# Altium project Anchor_G431.PrjPcb
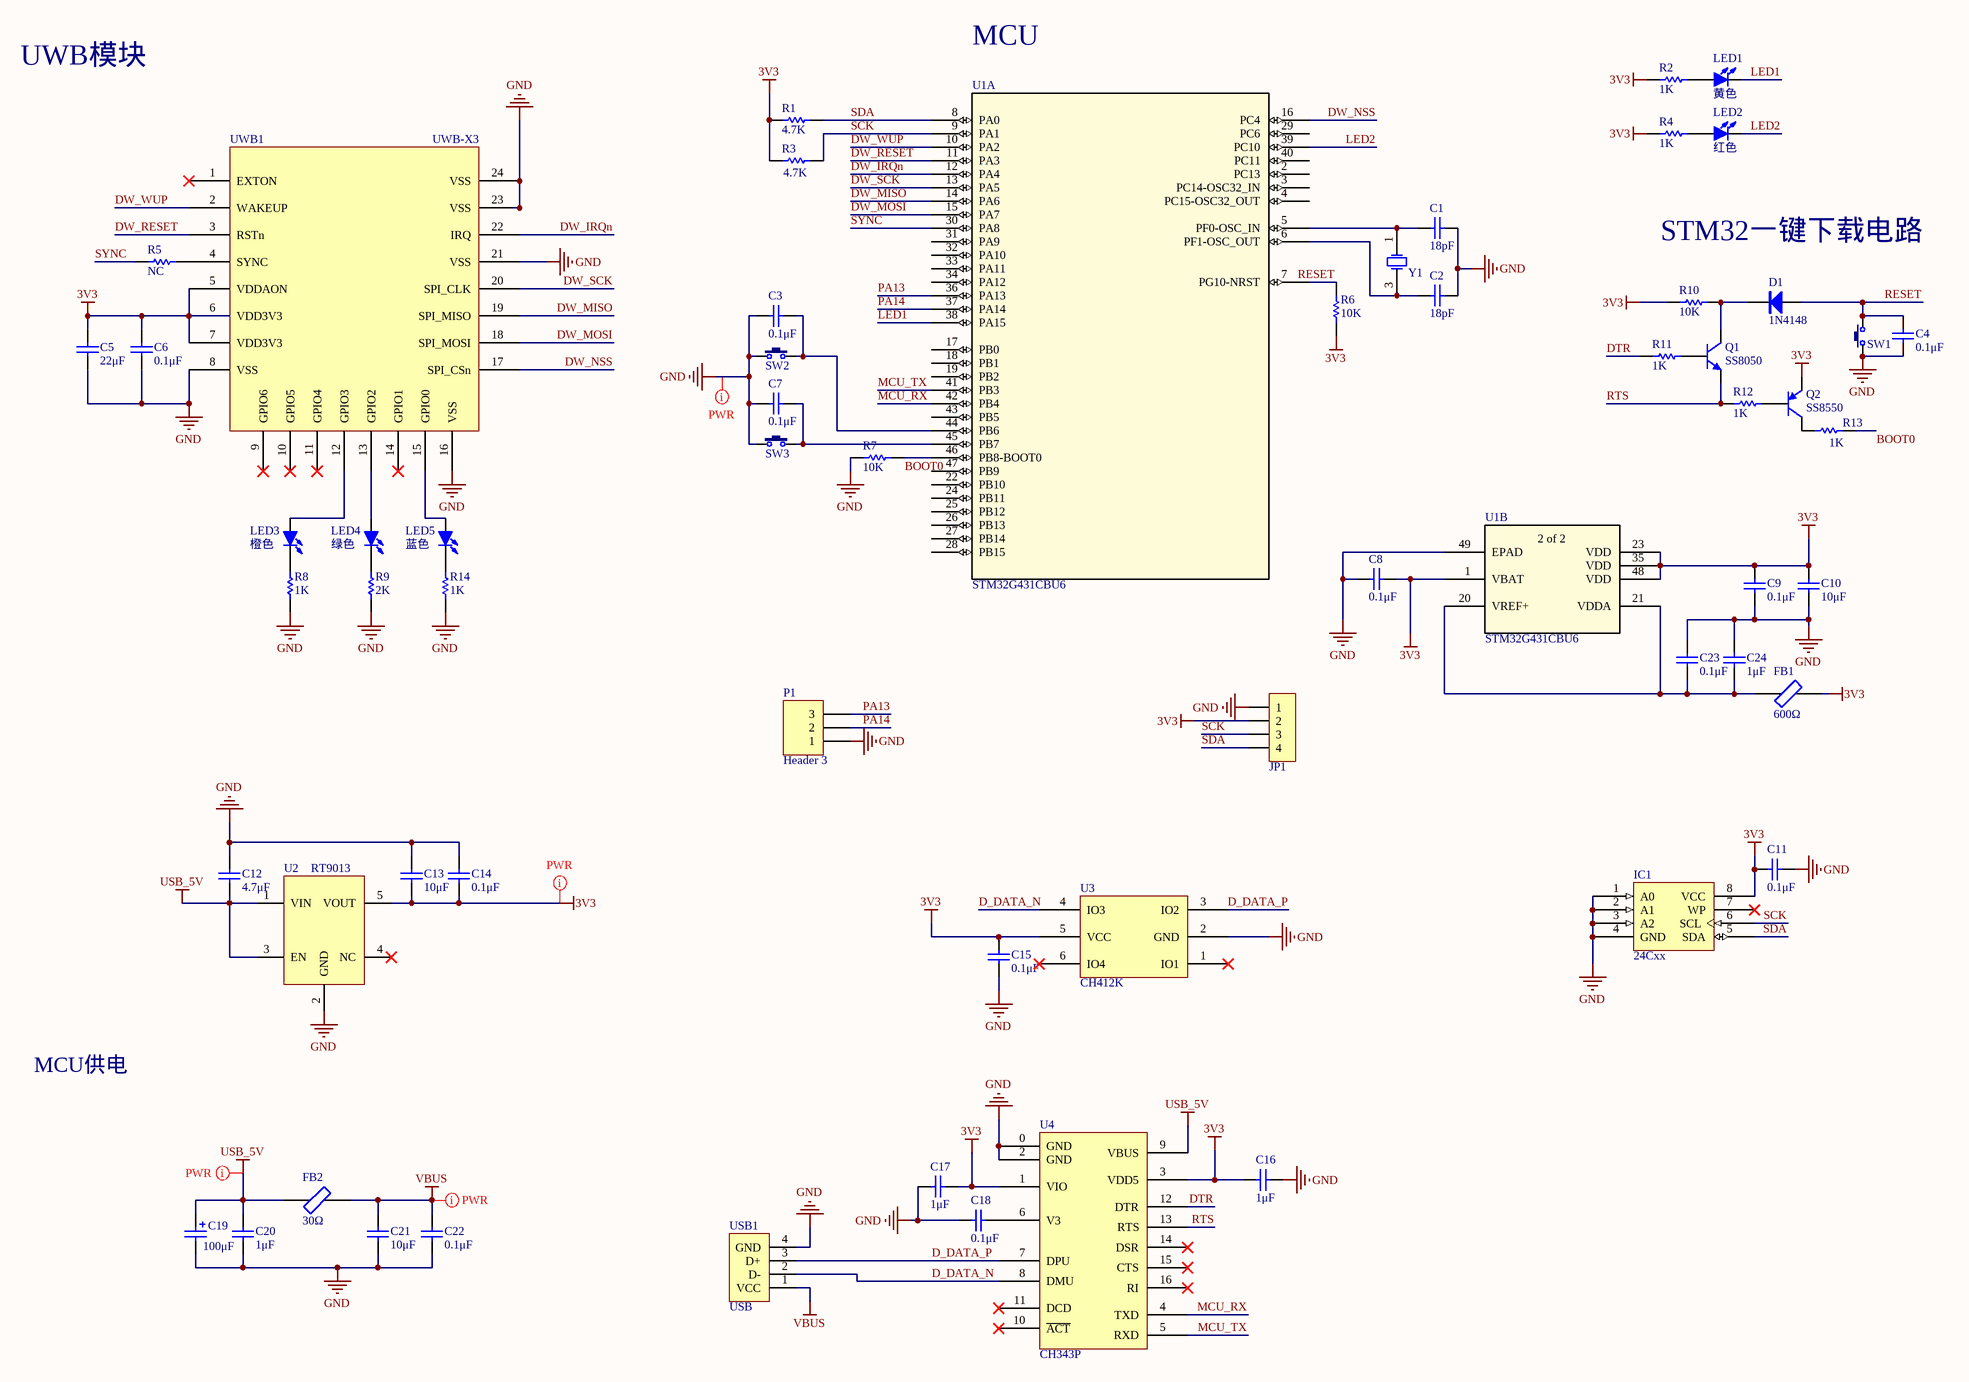
[diagram p0: Anchor_G431.SchDoc]
1 sheet, 61 parts. Net scope: global (net labels, ports and power ports of the same name join across sheets).
Board file: Anchor_G431.PcbDoc

## Sheet Anchor_G431.SchDoc
size A2; SheetNumber: 1; SheetTotal: 1

### Parts
C1  value 18pF  [C 0603_L]  (hidden comment: Cap)
C2  value 18pF  [C 0603_L]  (hidden comment: Cap)
C3  value 0.1μF  [C 0603_L]  (hidden comment: Cap)
C4  value 0.1μF  [C 0603_L]  (hidden comment: Cap)
C5  value 22μF  [C 0603_L]  (hidden comment: Cap)
C6  value 0.1μF  [C 0603_L]  (hidden comment: Cap)
C7  value 0.1μF  [C 0603_L]  (hidden comment: Cap)
C8  value 0.1μF  [C 0603_L]  (hidden comment: Cap)
C9  value 0.1μF  [C 0603_L]  (hidden comment: Cap)
C10  value 10μF  [C 0603_L]  (hidden comment: Cap)
C11  value 0.1μF  [C 0603_L]  (hidden comment: Cap)
C12  value 4.7μF  [C 0603_L]  (hidden comment: Cap)
C13  value 10μF  [C 0603_L]  (hidden comment: Cap)
C14  value 0.1μF  [C 0603_L]  (hidden comment: Cap)
C15  value 0.1μF  [C 0603_L]  (hidden comment: Cap)
C16  value 1μF  [C 0603_L]  (hidden comment: Cap)
C17  value 1μF  [C 0603_L]  (hidden comment: Cap)
C18  value 0.1μF  [C 0603_L]  (hidden comment: Cap)
C19  value 100μF  [CM C(5*5.4)]  (hidden comment: Cap Pol1)
C20  value 1μF  [C 0603_L]  (hidden comment: Cap)
C21  value 10μF  [C 0603_L]  (hidden comment: Cap)
C22  value 0.1μF  [C 0603_L]  (hidden comment: Cap)
C23  value 0.1μF  [C 0603_L]  (hidden comment: Cap)
C24  value 1μF  [C 0603_L]  (hidden comment: Cap)
D1  1N4148  [SOD-323]
FB1  value 600Ω  [C 0603_L]  (hidden comment: Ferrite bead)
FB2  value 30Ω  [C 0603_L]  (hidden comment: Ferrite bead)
IC1  24Cxx  [SOP8_L]
JP1  HDR-1X4  [HDR2.54-LI-4P]  (value not drawn)
LED1  黄色  [LED 0805G]
LED2  红色  [LED 0805R]
LED3  橙色  [LED 0805G]
LED4  绿色  [LED 0805G]
LED5  蓝色  [LED 0805G]
P1  Header 3  [HDR2.54-LI-3P]
Q1  SS8050  [SOT-23-3L]
Q2  SS8550  [SOT-23-3L]
R1  value 4.7K  [R 0603_L]  (hidden comment: Resistor)
R2  value 1K  [R 0603_L]  (hidden comment: Resistor)
R3  value 4.7K  [R 0603_L]  (hidden comment: Resistor)
R4  value 1K  [R 0603_L]  (hidden comment: Resistor)
R5  value NC  [R 0603_L]  (hidden comment: Resistor)
R6  value 10K  [R 0603_L]  (hidden comment: Resistor)
R7  value 10K  [R 0603_L]  (hidden comment: Resistor)
R8  value 1K  [R 0603_L]  (hidden comment: Resistor)
R9  value 2K  [R 0603_L]  (hidden comment: Resistor)
R10  value 10K  [R 0603_L]  (hidden comment: Resistor)
R11  value 1K  [R 0603_L]  (hidden comment: Resistor)
R12  value 1K  [R 0603_L]  (hidden comment: Resistor)
R13  value 1K  [R 0603_L]  (hidden comment: Resistor)
R14  value 1K  [R 0603_L]  (hidden comment: Resistor)
SW1  3x6x5  [TSW SMD-3*6*2.5]  (value not drawn)
SW2  3x6x5  [TSW SMD-3*6*2.5]  (value not drawn)
SW3  3x6x5  [TSW SMD-3*6*2.5]  (value not drawn)
U1  STM32G431CBU6  [UFQFPN-48_7X7X0P55MM]  (parts A,B of 2)
U2  RT9013  [SOT23-5L]
U3  CH412K  [SOT-363]
U4  CH343P  [QFN16]
USB1  USB  [USB_A/P_B]
UWB1  UWB-X3  [UWB-X3-MAX-IPEX]
Y1  8MHz ±20ppm 20pF  [OSC 3225-4P]  (value not drawn)

### Nets
3V3: C5.2 C6.1 C8.1 C9.2 C10.2 C11.2 C13.1 C14.1 C15.2 C16.1 C17.2 FB1.2 IC1.8(VCC) JP1.2 Q2.2(E) R1.1 R2.2 R3.1 R4.2 R6.2 R10.1 U1.1(VBAT) U1.23(VDD) U1.35(VDD) U1.48(VDD) U2.5(VOUT) U3.5(VCC) U4.1(VIO) U4.3(VDD5) UWB1.5(VDDAON) UWB1.6(VDD3V3) UWB1.7(VDD3V3)
GND: C1.1 C2.1 C3.2 C4.1 C5.1 C6.2 C7.2 C8.2 C9.1 C10.1 C11.1 C12.2 C13.2 C14.2 C15.1 C16.2 C17.1 C18.1 C19.2 C20.1 C21.1 C22.1 C23.2 C24.2 IC1.1(A0) IC1.2(A1) IC1.3(A2) IC1.4(GND) JP1.1 P1.1 R7.1 R8.2 R9.2 R14.2 SW1.1 SW2.1 SW3.1 U1.49(EPAD) U2.2(GND) U3.2(GND) U4.0(GND) U4.2(GND) USB1.4(GND) UWB1.8(VSS) UWB1.16(VSS) UWB1.21(VSS) UWB1.23(VSS) UWB1.24(VSS)
USB_5V: C12.1 C19.1 C20.2 FB2.1 U2.1(VIN) U2.3(EN) U4.9(VBUS)
VBUS: C21.2 C22.2 FB2.2 USB1.1(VCC)
BOOT0: R7.2 R13.2 U1.46(PB8-BOOT0)
D_DATA_N: U3.4(IO3) U4.8(DMU) USB1.2(D-)
D_DATA_P: U3.3(IO2) U4.7(DPU) USB1.3(D+)
DTR: R11.1 U4.12(DTR)
DW_IRQn: U1.12(PA4) UWB1.22(IRQ)
DW_MISO: U1.14(PA6) UWB1.19(SPI_MISO)
DW_MOSI: U1.15(PA7) UWB1.18(SPI_MOSI)
DW_NSS: U1.16(PC4) UWB1.17(SPI_CSn)
DW_RESET: U1.11(PA3) UWB1.3(RSTn)
DW_SCK: U1.13(PA5) UWB1.20(SPI_CLK)
DW_WUP: U1.10(PA2) UWB1.2(WAKEUP)
LED1: LED1.2(K) U1.38(PA15)
LED2: LED2.2(K) U1.39(PC10)
MCU_RX: U1.42(PB4) U4.4(TXD)
MCU_TX: U1.41(PB3) U4.5(RXD)
PA13: P1.3 U1.36(PA13)
PA14: P1.2 U1.37(PA14)
RESET: C4.2 D1.1(A) R6.1 SW1.2 U1.7(PG10-NRST)
RTS: Q1.2(E) R12.1 U4.13(RTS)
SCK: IC1.6(SCL) JP1.3 R3.2 U1.9(PA1)
SDA: IC1.5(SDA) JP1.4 R1.2 U1.8(PA0)
SYNC: R5.1 U1.30(PA8)
NetC1_2: C1.2 U1.5(PF0-OSC_IN) Y1.1(OSC1)
NetC2_2: C2.2 U1.6(PF1-OSC_OUT) Y1.3(OSC2)
NetC3_1: C3.1 SW2.2 U1.44(PB6)
NetC7_1: C7.1 SW3.2 U1.45(PB7)
NetC18_2: C18.2 U4.6(V3)
NetC23_1: C23.1 C24.1 FB1.1 U1.20(VREF+) U1.21(VDDA)
NetD1_2: D1.2(K) Q1.3(C) R10.2
NetLED1_1: LED1.1(A) R2.1
NetLED2_1: LED2.1(A) R4.1
NetLED3_1: LED3.1(A) UWB1.12(GPIO3)
NetLED3_2: LED3.2(K) R8.1
NetLED4_1: LED4.1(A) UWB1.13(GPIO2)
NetLED4_2: LED4.2(K) R9.1
NetLED5_1: LED5.1(A) UWB1.15(GPIO0)
NetLED5_2: LED5.2(K) R14.1
NetQ1_1: Q1.1(B) R11.2
NetQ2_1: Q2.1(B) R12.2
NetQ2_3: Q2.3(C) R13.1
NetR5_2: R5.2 UWB1.4(SYNC)

Not connected (* = marked no-connect by the designer): IC1 7(WP)*; U1 2(PC13) 3(PC14-OSC32_IN) 4(PC15-OSC32_OUT) 17(PB0) 18(PB1) 19(PB2) 22(PB10) 24(PB11) 25(PB12) 26(PB13) 27(PB14) 28(PB15) 29(PC6) 31(PA9) 32(PA10) 33(PA11) 34(PA12) 40(PC11) 43(PB5) 47(PB9); U2 4(NC)*; U3 1(IO1)* 6(IO4)*; U4 10(~{ACT})* 11(DCD)* 14(DSR)* 15(CTS)* 16(RI)*; UWB1 1(EXTON)* 9(GPIO6)* 10(GPIO5)* 11(GPIO4)* 14(GPIO1)*

### Layout directives
net class PWR: 3V3, GND, USB_5V, VBUS

### Notes on the sheet
- UWB模块
- MCU
- STM32一键下载电路
- MCU供电
- (in symbol STM32G431CBU6, part B) 2 of 2

### Library data of the parts
C1-C18 C20-C24 = Cap: Capacitor; Published: 8-Jun-2000; LatestRevisionDate: 17-Jul-2002; LatestRevisionNote: Re-released for DXP Platform.; PackageReference: RAD-0.3; Publisher: Altium Limited; PackageDescription: Radial Cap, Thru-Hole; 2 Leads; 0.3 in Pin Spacing
C19 = Cap Pol1: Polarized Capacitor (Radial); Published: 8-Jun-2000; LatestRevisionDate: 17-Jul-2002; LatestRevisionNote: Re-released for DXP Platform.; PackageReference: RB7.6-15; Publisher: Altium Limited
D1 = 1N4148: 开关二极管; BOM名称: 高速开关二极管; 淘宝ID: 封装库来自淘宝 ID：黄晶宝石; 欢迎光临: https://shop463601444.taobao.com
FB1 FB2 = Ferrite bead: 铁氧体磁珠
IC1 = 24Cxx: 外置EEPROM; 版权归属: 封装库来自淘宝 ID：黄晶宝石; BOM名称: 外置EEPROM; 唯一出售店铺网址: https://shop463601444.taobao.com
JP1 = Header 4: 4P接插件; 版权归属: 封装库来自淘宝 ID：黄晶宝石; BOM名称: 4P接插件; 学习资源: https://shop463601444.taobao.com
LED1-LED5 = LED-SMD: 贴片LED; 版权归属: 封装库来自淘宝 ID：黄晶宝石; BOM名称: 贴片LED; 学习资源: https://shop463601444.taobao.com
P1 = Header 3: Header, 3-Pin; LatestRevisionDate: 17-Jul-2002; LatestRevisionNote: Re-released for DXP Platform.; Publisher: Altium Limited
Q1 = 8050-SMD: 高频放大-NPN型; 版权归属: 封装库来自淘宝 ID：黄晶宝石; 属性: 40V 1.5A 1W 100MHZ; BOM名称: 高频放大-NPN型; 联系售后: https://shop463601444.taobao.com
Q2 = 8550-SMD: 高频放大-PNP型; 版权归属: 封装库来自淘宝 ID：黄晶宝石; 属性: 40V 1.5A 1W 100MHZ; BOM名称: 高频放大-PNP型; 学习资源: www.ooocke.com
SW1-SW3 = TSW 3x6: 3x6轻触开关; 版权归属: 封装库来自淘宝 ID：黄晶宝石; BOM名称: 3x6轻触开关; 学习资源: https://shop463601444.taobao.com
U1 = STM32G431CBU6: No Description Available; Mfr_Name: STMicroelectronics; Copyright: Copyright (C) 2023 Ultra Librarian. All rights reserved.; Manufacturer_Part_Number: STM32G431CBU6; RefDes: RefDes; Type: DEV
U2 = RT9013: LDO
U3 = CH412K: 四路ESD保护
U4 = CH343: USB转串口
USB1 = USB-A/P: USB-A型公接口; 版权归属: 封装库来自淘宝卖家 ID：黄晶宝石; BOM名称: USB-A型公接口; 学习资源: https://shop463601444.taobao.com
UWB1 = UWB-X3(DWM3000)
Y1 = SMD-5032_2P 8MHz 20ppm 20pF: 贴片晶振; ComponentLink1Description: 供应商链接; ComponentLink1URL: http://www.szlcsc.com/product/details_117214.html; Package: SMD-5032_2P; Supplier: LC; SuppliersPartNumber: C115962
R1-R14 = Resistor: Published: 8-Jun-2000; LatestRevisionDate: 17-Jul-2002; LatestRevisionNote: Re-released for DXP Platform.; PackageReference: AXIAL-0.5; Publisher: Altium Limited